# EAGLE design Uno&mux74hc151 (EAGLE 9.6.2)
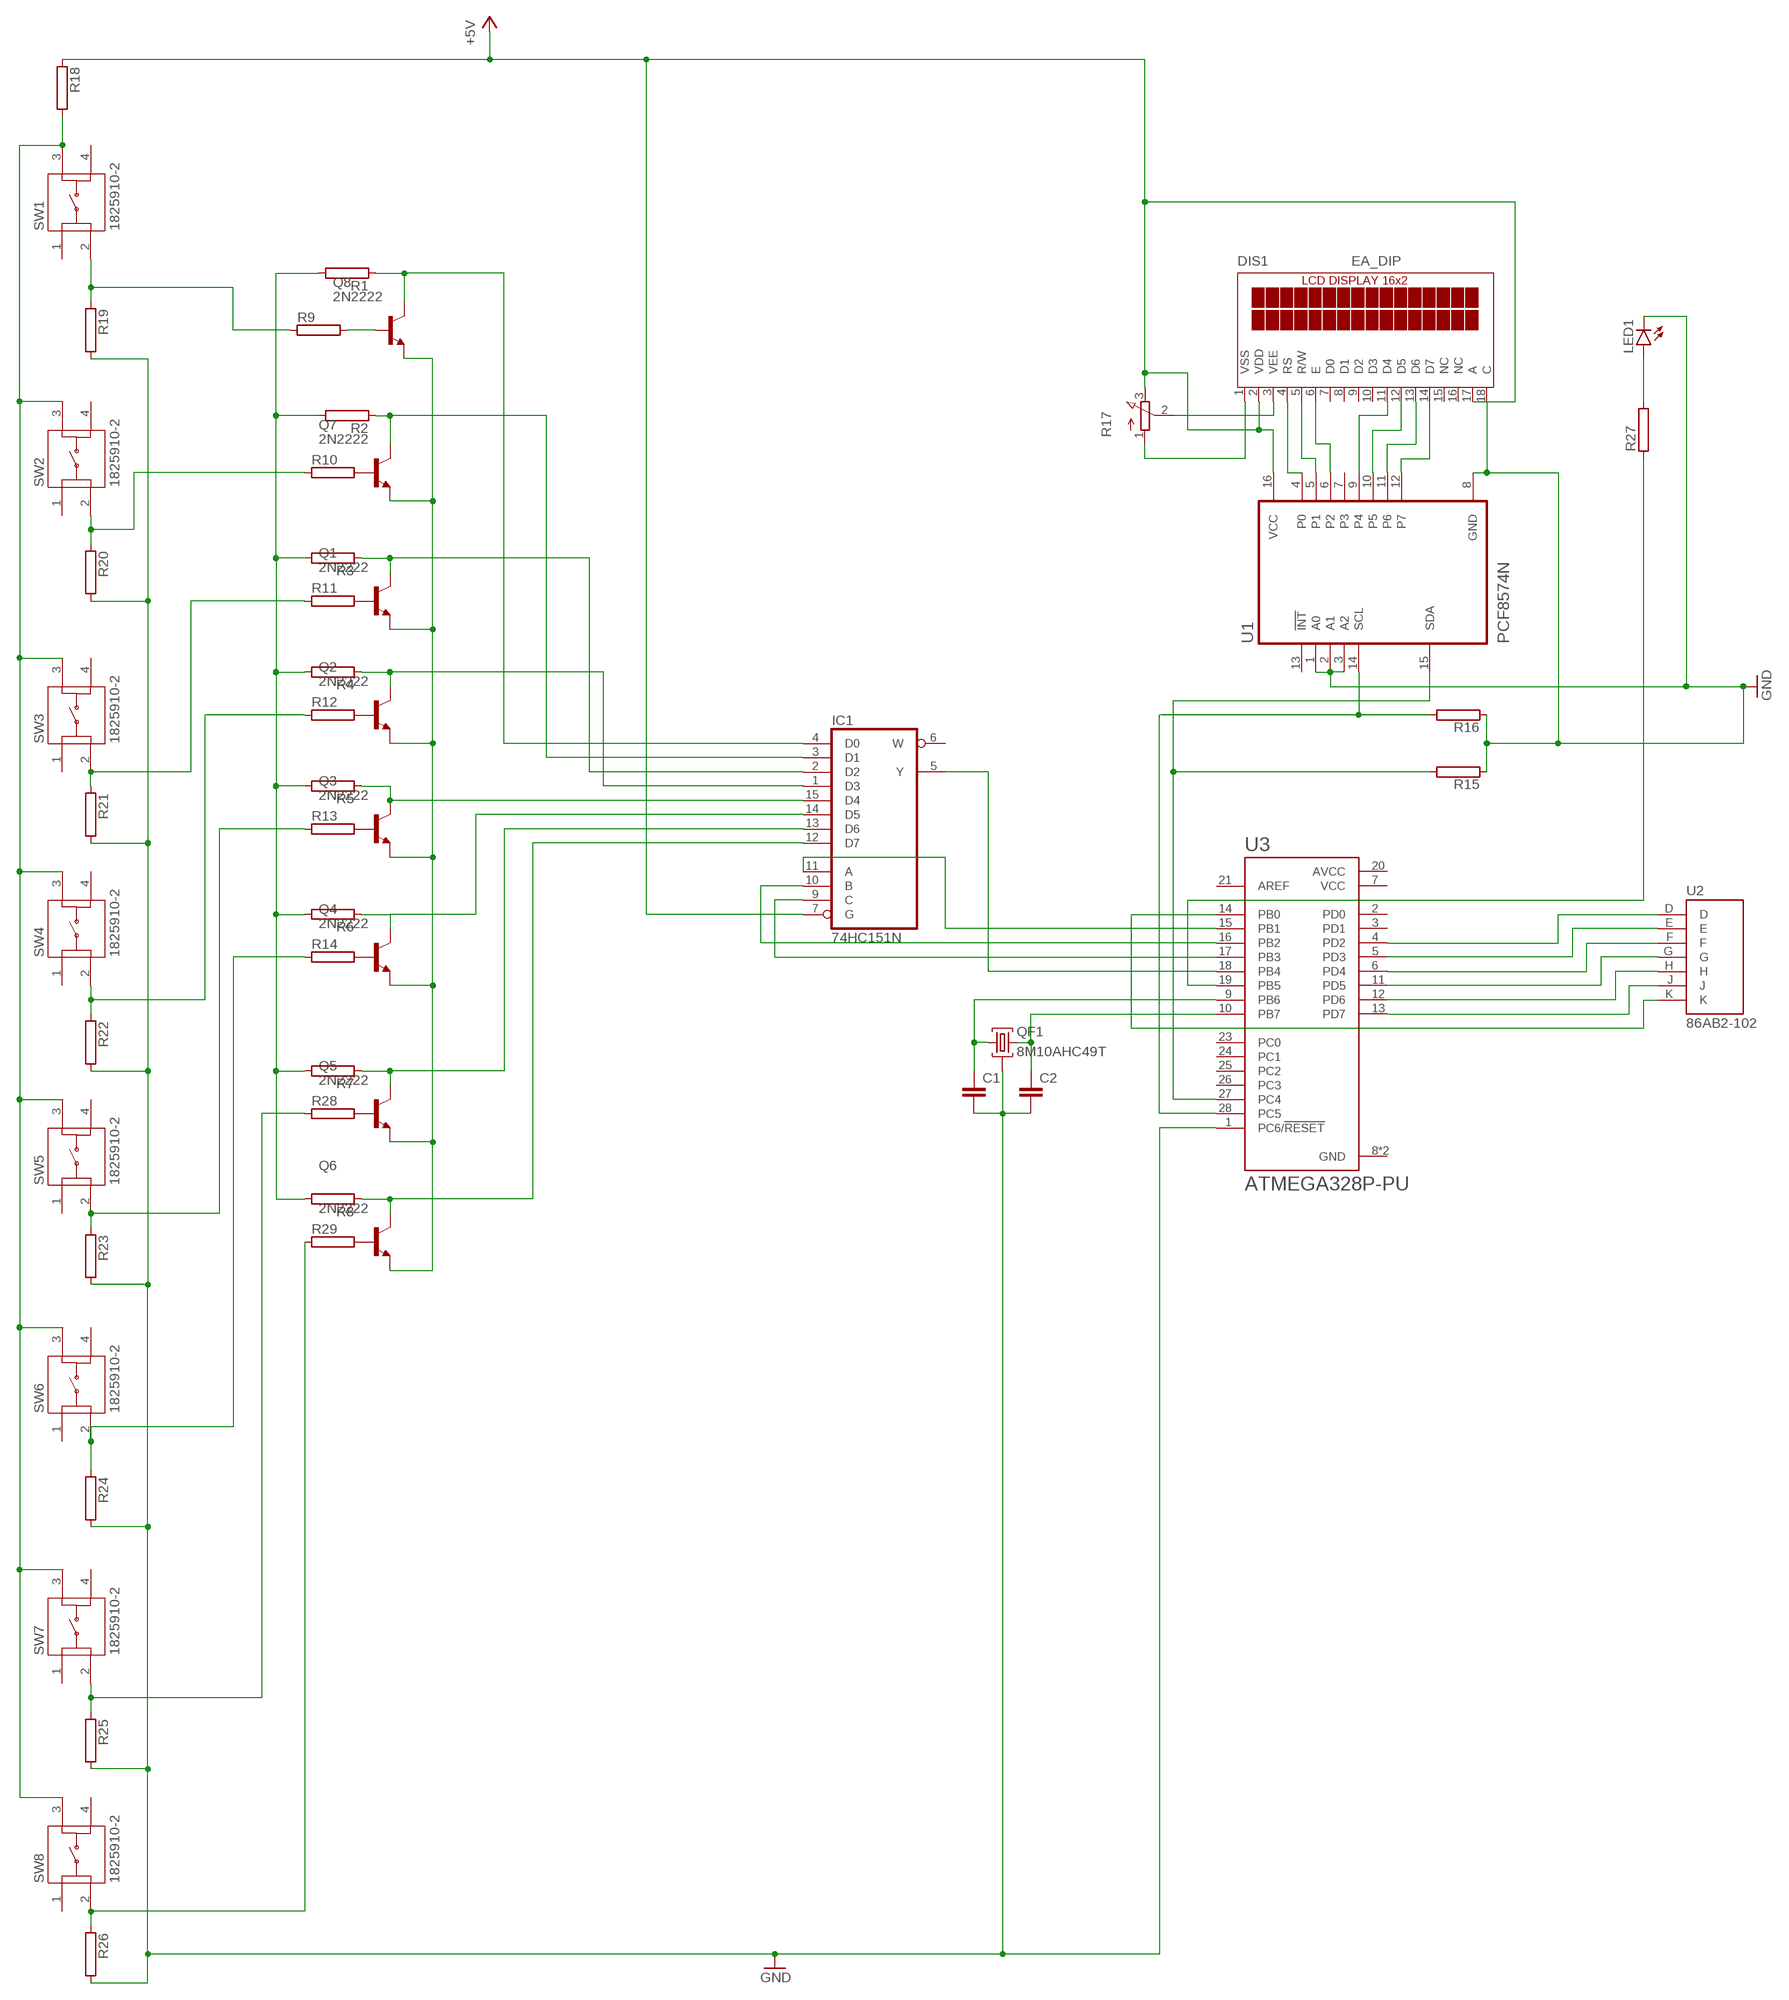
[diagram p0: schematic, sheet 1]

## Parts
C1  C2.5/2  [C2.5-2]
C2  C2.5/2  [C2.5-2]
DIS1  EA_DIP  [EA_DIP]
IC1  74HC151N  [DIL16]
LED1  LEDB153  [Q62902-B153]
Q1  2N2222  [TO18]
Q2  2N2222  [TO18]
Q3  2N2222  [TO18]
Q4  2N2222  [TO18]
Q5  2N2222  [TO18]
Q6  2N2222  [TO18]
Q7  2N2222  [TO18]
Q8  2N2222  [TO18]
QF1  8M10AHC49T  [HC49U]
R1  RAC01  [AC01]
R2  RAC01  [AC01]
R3  RAC01  [AC01]
R4  RAC01  [AC01]
R5  RAC01  [AC01]
R6  RAC01  [AC01]
R7  RAC01  [AC01]
R8  RAC01  [AC01]
R9  RAC01  [AC01]
R10  RAC01  [AC01]
R11  RAC01  [AC01]
R12  RAC01  [AC01]
R13  RAC01  [AC01]
R14  RAC01  [AC01]
R15  RAC01  [AC01]
R16  RAC01  [AC01]
R17  3RP/1610N  [3RP/1610N]
R18  RAC01  [AC01]
R19  RAC01  [AC01]
R20  RAC01  [AC01]
R21  RAC01  [AC01]
R22  RAC01  [AC01]
R23  RAC01  [AC01]
R24  RAC01  [AC01]
R25  RAC01  [AC01]
R26  RAC01  [AC01]
R27  RAC01  [AC01]
R28  RAC01  [AC01]
R29  RAC01  [AC01]
SW1  1825910-2  [TE_1825910-2]
SW2  1825910-2  [TE_1825910-2]
SW3  1825910-2  [TE_1825910-2]
SW4  1825910-2  [TE_1825910-2]
SW5  1825910-2  [TE_1825910-2]
SW6  1825910-2  [TE_1825910-2]
SW7  1825910-2  [TE_1825910-2]
SW8  1825910-2  [TE_1825910-2]
U1  PCF8574N  [DIP794W45P254L1969H508Q16]
U2  86AB2-102  [KEYPAD_86AB2-102]
U3  ATMEGA328P-PU  [DIP794W46P254L2967H457Q28B]

## Nets
+5V: DIS1.2(VDD) DIS1.17(A) IC1.7(G) R17.3(E) R18.1 U1.16(VCC)
GND: C1.2 C2.2 DIS1.18(C) LED1.K(C) QF1.2 R15.1 R16.1 R19.2 R20.2 R21.2 R22.2 R23.2 R24.2 R25.2 R26.2 U1.1(A0) U1.2(A1) U1.3(A2) U1.8(GND) U3.1(PC6/!RESET)
N$1: R16.2 U1.14(SCL) U3.28(PC5)
N$2: R15.2 U1.15(SDA) U3.27(PC4)
N$3: U2.D U3.4(PD2)
N$4: U2.E U3.5(PD3)
N$5: U2.F U3.6(PD4)
N$6: U2.G U3.11(PD5)
N$7: DIS1.14(D7) U1.12(P7)
N$8: DIS1.13(D6) U1.11(P6)
N$9: DIS1.11(D4) U1.9(P4)
N$10: DIS1.12(D5) U1.10(P5)
N$11: DIS1.6(E) U1.6(P2)
N$12: DIS1.5(R/W) U1.5(P1)
N$13: DIS1.4(RS) U1.4(P0)
N$14: LED1.A R27.2
N$15: IC1.5(Y) U3.18(PB4)
N$16: R10.1 R20.1 SW2.2
N$17: IC1.3(D1) Q7.3(C) R2.1
N$18: IC1.2(D2) Q1.3(C) R3.1
N$19: IC1.1(D3) Q2.3(C) R4.1
N$20: IC1.15(D4) Q3.3(C) R5.1
N$21: IC1.14(D5) Q4.3(C) R6.1
N$22: IC1.13(D6) Q5.3(C) R7.1
N$23: IC1.12(D7) Q6.3(C) R8.1
N$24: Q6.2(B) R29.2
N$25: Q5.2(B) R28.2
N$26: Q4.2(B) R14.2
N$27: Q3.2(B) R13.2
N$28: Q2.2(B) R12.2
N$29: Q1.2(B) R11.2
N$30: Q7.2(B) R10.2
N$31: Q8.2(B) R9.2
N$32: R1.2 R2.2 R3.2 R4.2 R5.2 R6.2 R7.2 R8.2
N$33: R9.1 R19.1 SW1.2
N$36: R12.1 R22.1 SW4.2
N$37: R13.1 R23.1 SW5.2
N$38: R14.1 R24.1 SW6.2
N$39: R25.1 R28.1 SW7.2
N$41: C2.1 QF1.3 U3.10(PB7)
N$42: C1.1 QF1.1 U3.9(PB6)
N$43: Q1.1(E) Q2.1(E) Q3.1(E) Q4.1(E) Q5.1(E) Q6.1(E) Q7.1(E) Q8.1(E)
N$44: IC1.4(D0) Q8.3(C) R1.1
N$45: IC1.11(A) U3.15(PB1)
N$46: R18.2 SW1.3 SW2.3 SW3.3 SW4.3 SW5.3 SW6.3 SW7.3 SW8.3
N$47: U2.H U3.12(PD6)
N$48: U2.J U3.13(PD7)
N$49: IC1.10(B) U3.16(PB2)
N$50: U2.K U3.14(PB0)
N$51: IC1.9(C) U3.17(PB3)
N$52: R11.1 R21.1 SW3.2
N$53: DIS1.1(VSS) R17.1(A)
N$54: DIS1.3(VEE) R17.2(S)
N$57: R27.1 U3.19(PB5)
N$58: R26.1 R29.1 SW8.2
Unconnected: DIS1.7(D0) DIS1.8(D1) DIS1.9(D2) DIS1.10(D3) DIS1.15(NC) DIS1.16(NC) IC1.6(W) SW1.1 SW1.4 SW2.1 SW2.4 SW3.1 SW3.4 SW4.1 SW4.4 SW5.1 SW5.4 SW6.1 SW6.4 SW7.1 SW7.4 SW8.1 SW8.4 U1.7(P3) U1.13(!INT) U3.2(PD0) U3.3(PD1) U3.21(AREF) U3.23(PC0) U3.24(PC1) U3.25(PC2) U3.26(PC3)

## Power pins joined to a net without a drawn wire
AVCC: U3.20(AVCC)
GND: IC1.8(GND) U3.8(GND) U3.22(GND)
VCC: IC1.16(VCC) U3.7(VCC)

## Library data of the parts
C1 C2 = capacitor-wima:C: CAPACITOR naming: grid - package width
DIS1 = display-lcd:EA_DIP: LCD-MODUL 2x16 - 6,68mm, INKL. KONTROLLER HD44780 Source: Data sheet <http://www.lcd-module.de/pdf/doma/dip162-d.pdf>
IC1 = 74xx-eu:74*151: Data SELECTOR/MULTIPLEXER
LED1 = led:LED: LED OSRAM: - CHIPLED LG R971, LG N971, LY N971, LG Q971, LY Q971, LO R971, LY R971 LH N974, LH R974 LS Q976, LO Q976, LY Q976 LO Q996 - Hyper CHIPLED LW Q18S LB Q993, LB Q99A, LB R99A - SideLED LS A670, LO A670, LY A670, LG A670, LP A670 LB A673, LV A673, LT A673, LW A673 LH A674 LY A675 LS A676, LA A676, LO A676, LY A676, LW A676 LS A679, LY A679, LG A679 - Hyper Micro SIDELED® LS Y876, LA Y876, LO Y876, LY Y876 LT Y87S - SmartLED LW L88C, LW L88S LB L89C, LB L89S, LG L890 LS L89K, LO L89K, LY L89K LS L896, LA L896, LO L896, LY L896 - TOPLED LS T670, LO T670, LY T670, LG T670, LP T670 LSG T670, LSP T670, LSY T670, LOP T670, LYG T670 LG T671, LOG T671, LSG T671 LB T673, LV T673, LT T673, LW T673 LH T674 LS T676, LA T676, LO T676, LY T676, LB T676, LH T676, LSB T676, LW T676 LB T67C, LV T67C, LT T67C, LS T67K, LO T67K, LY T67K, LW E67C LS E67B, LA E67B, LO E67B, LY E67B, LB E67C, LV E67C, LT E67C LW T67C LS T679, LY T679, LG T679 LS T770, LO T770, LY T770, LG T770, LP T770 LB T773, LV T773, LT T773, LW T773 LH T774 LS E675, LA E675, LY E675, LS T675 LS T776, LA T776, LO T776, LY T776, LB T776 LHGB T686 LT T68C, LB T68C - Hyper Mini TOPLED® LB M676 - Mini TOPLED Santana® LG M470 LS M47K, LO M47K, LY M47K Source: http://www.osram.convergy.de LUXEON: - LUMILED® LXK2-PW12-R00, LXK2-PW12-S00, LXK2-PW14-U00, LXK2-PW14-V00 LXK2-PM12-R00, LXK2-PM12-S00, LXK2-PM14-U00 LXK2-PE12-Q00, LXK2-PE12-R00, LXK2-PE12-S00, LXK2-PE14-T00, LXK2-PE14-U00 LXK2-PB12-K00, LXK2-PB12-L00, LXK2-PB12-M00, LXK2-PB14-N00, LXK2-PB14-P00, LXK2-PB14-Q00 LXK2-PR12-L00, LXK2-PR12-M00, LXK2-PR14-Q00, LXK2-PR14-R00 LXK2-PD12-Q00, LXK2-PD12-R00, LXK2-PD12-S00 LXK2-PH12-R00, LXK2-PH12-S00 LXK2-PL12-P00, LXK2-PL12-Q00, LXK2-PL12-R00 Source: www.luxeon.com KINGBRIGHT: KA-3528ASYC Source: www.kingbright.com
Q1-Q8 = transistor-npn:2N2222*: NPN Transistor
QF1 = crystal:8M10AHC49T: Monolithic Crystal Filters Source: www.vanlong.com; OC_FARNELL: unknown; OC_NEWARK: unknown
R1-R16 R18-R29 = resistor-power:R: Power Resitor; OC_FARNELL: unknown; OC_NEWARK: unknown
R17 = pot:3RP/1610N: 16mm Potentiometer one level Source: http://www.alphapotentiometers.net/html/16mm_pot_2.html
SW1-SW8 = 1825910-2:1825910-2: SWITCH TACTILE SPST-NO 0.05A 24V Check availability <https://pricing.snapeda.com/parts/1825910-2/TE%20Connectivity/view-part?ref=eda>; AVAILABILITY: In Stock; COMMENT: 1825910-2; CONFIGURATION_POLE-THROW: Single Pole - Single Throw; CONTACT_CURRENT_RATING: 50 mA; DESCRIPTION: 50 mA SPST Round Actuator 160 Gram Force Tactile Pushbutton Switch; EU_ROHS_COMPLIANCE: Compliant; MF: TE Connectivity; MP: 1825910-2; PACKAGE: None; PRICE: None; PURCHASE-URL: https://pricing.snapeda.com/search/part/1825910-2/?ref=eda
U1 = PCF8574N:PCF8574N: Check availability <https://pricing.snapeda.com/parts/PCF8574N/Texas%20Instruments/view-part?ref=eda>; AVAILABILITY: In Stock; DESCRIPTION: 8-bit 2.5- to 5.5-V I2C/SMBus I/O expander with interrupt; MF: Texas Instruments; MP: PCF8574N; PACKAGE: PDIP-16 Texas Instruments; PRICE: None; PURCHASE-URL: https://pricing.snapeda.com/search/part/PCF8574N/?ref=eda
U2 = 86AB2-102:86AB2-102: Keypad Switch 12 Polymer Keys Snap Dome Contacts Matrix Output Non-Illuminated 0.01A 24VDC Check availability <https://pricing.snapeda.com/parts/86AB2-102/Grayhill%20Inc./view-part?ref=eda>; AVAILABILITY: In Stock; DESCRIPTION: Keypad Switch 12 Polymer Keys Snap Dome Contacts Matrix Output Non-Illuminated 0.01A @ 24VDC; MF: Grayhill Inc.; MP: 86AB2-102; PACKAGE: None; PRICE: None; PURCHASE-URL: https://pricing.snapeda.com/search/part/86AB2-102/?ref=eda
U3 = ATMEGA328P-PU:ATMEGA328P-PU: ATmega Series 20 MHz 32 KB Flash 2 KB SRAM 8-Bit Microcontroller - DIP-28 Check availability <https://pricing.snapeda.com/parts/ATMEGA328P-PU/Microchip/view-part?ref=eda>; AVAILABILITY: In Stock; DESCRIPTION: AVR AVR® ATmega Microcontroller IC 8-Bit 20MHz 32KB (16K x 16) FLASH 28-PDIP; MF: Microchip; MP: ATMEGA328P-PU; PACKAGE: PDIP-28 Atmel; PRICE: None; PURCHASE-URL: https://pricing.snapeda.com/search/part/ATMEGA328P-PU/?ref=eda

## Board
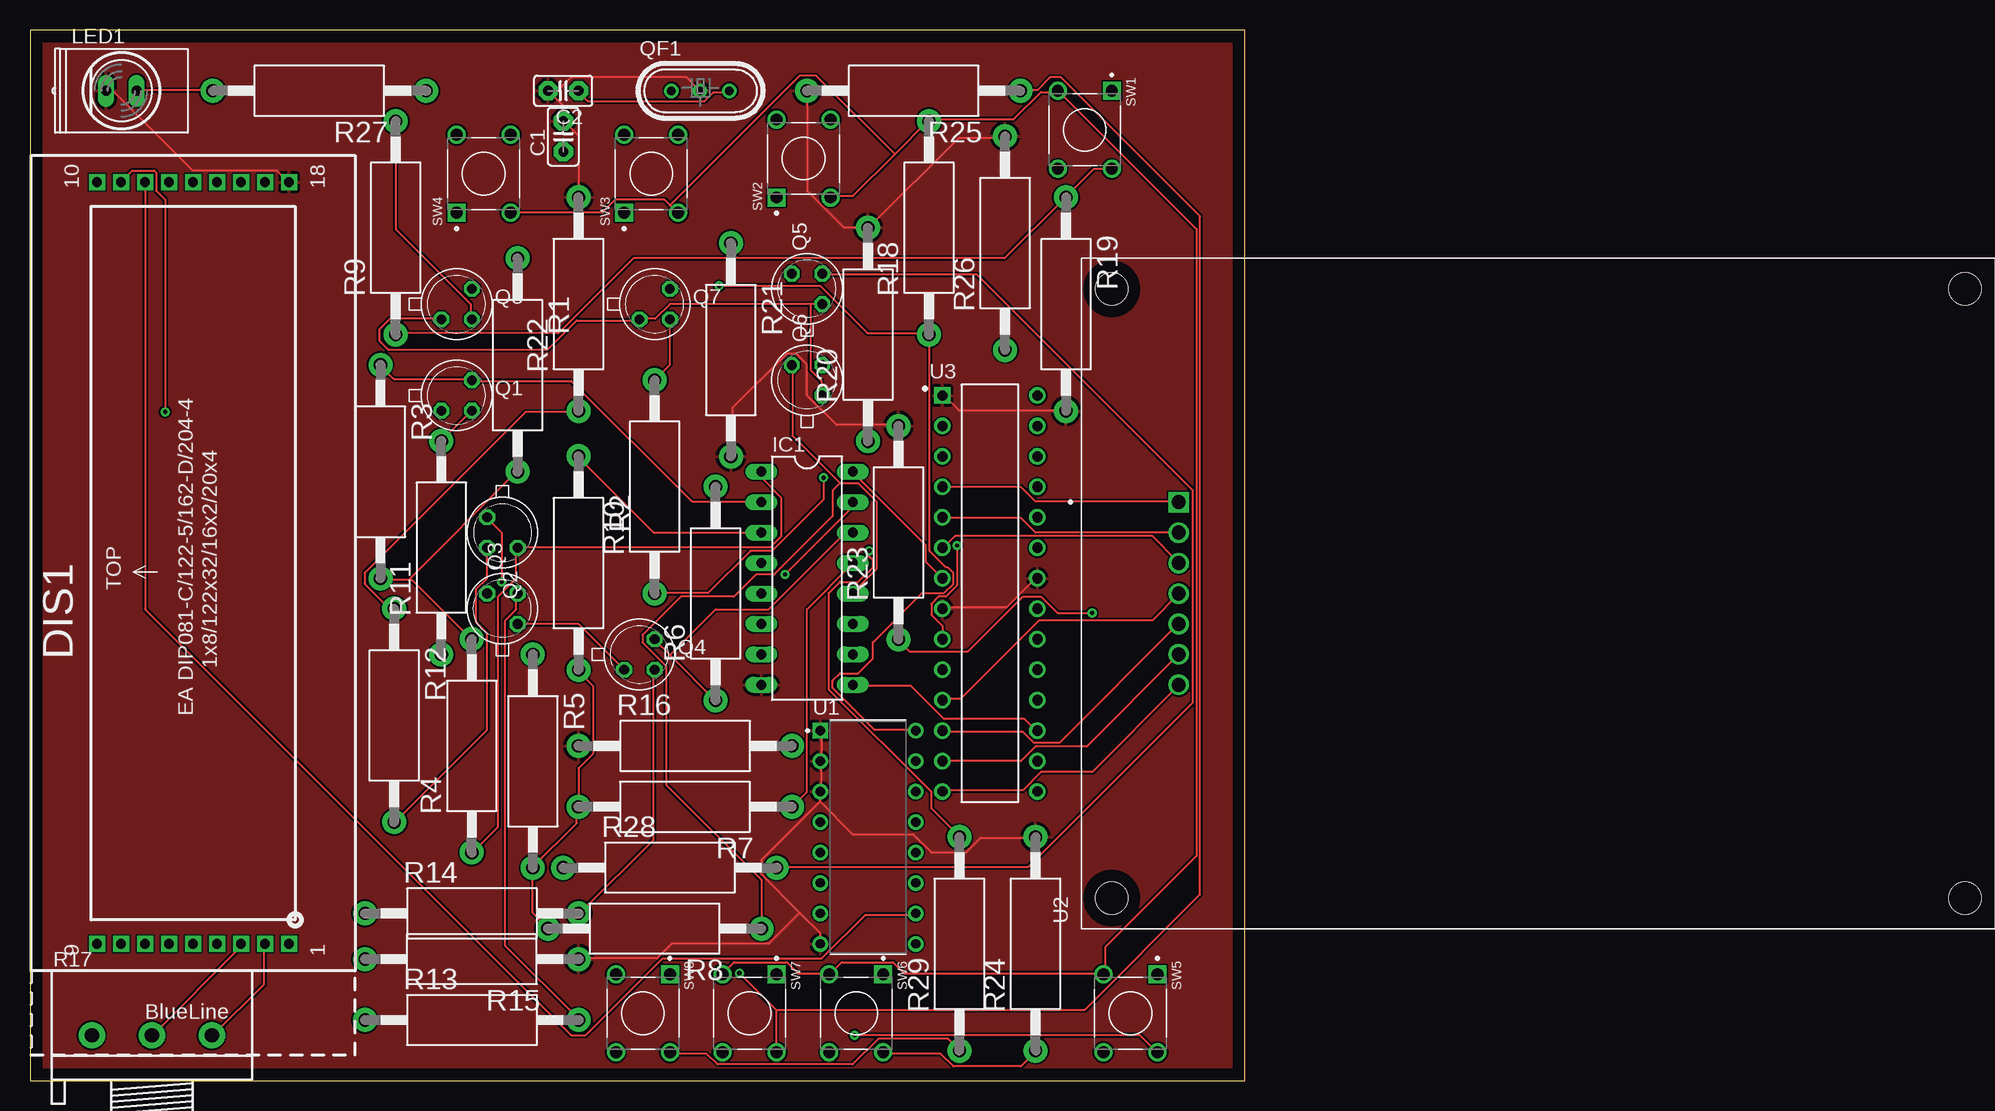
[diagram p1: board, top side]
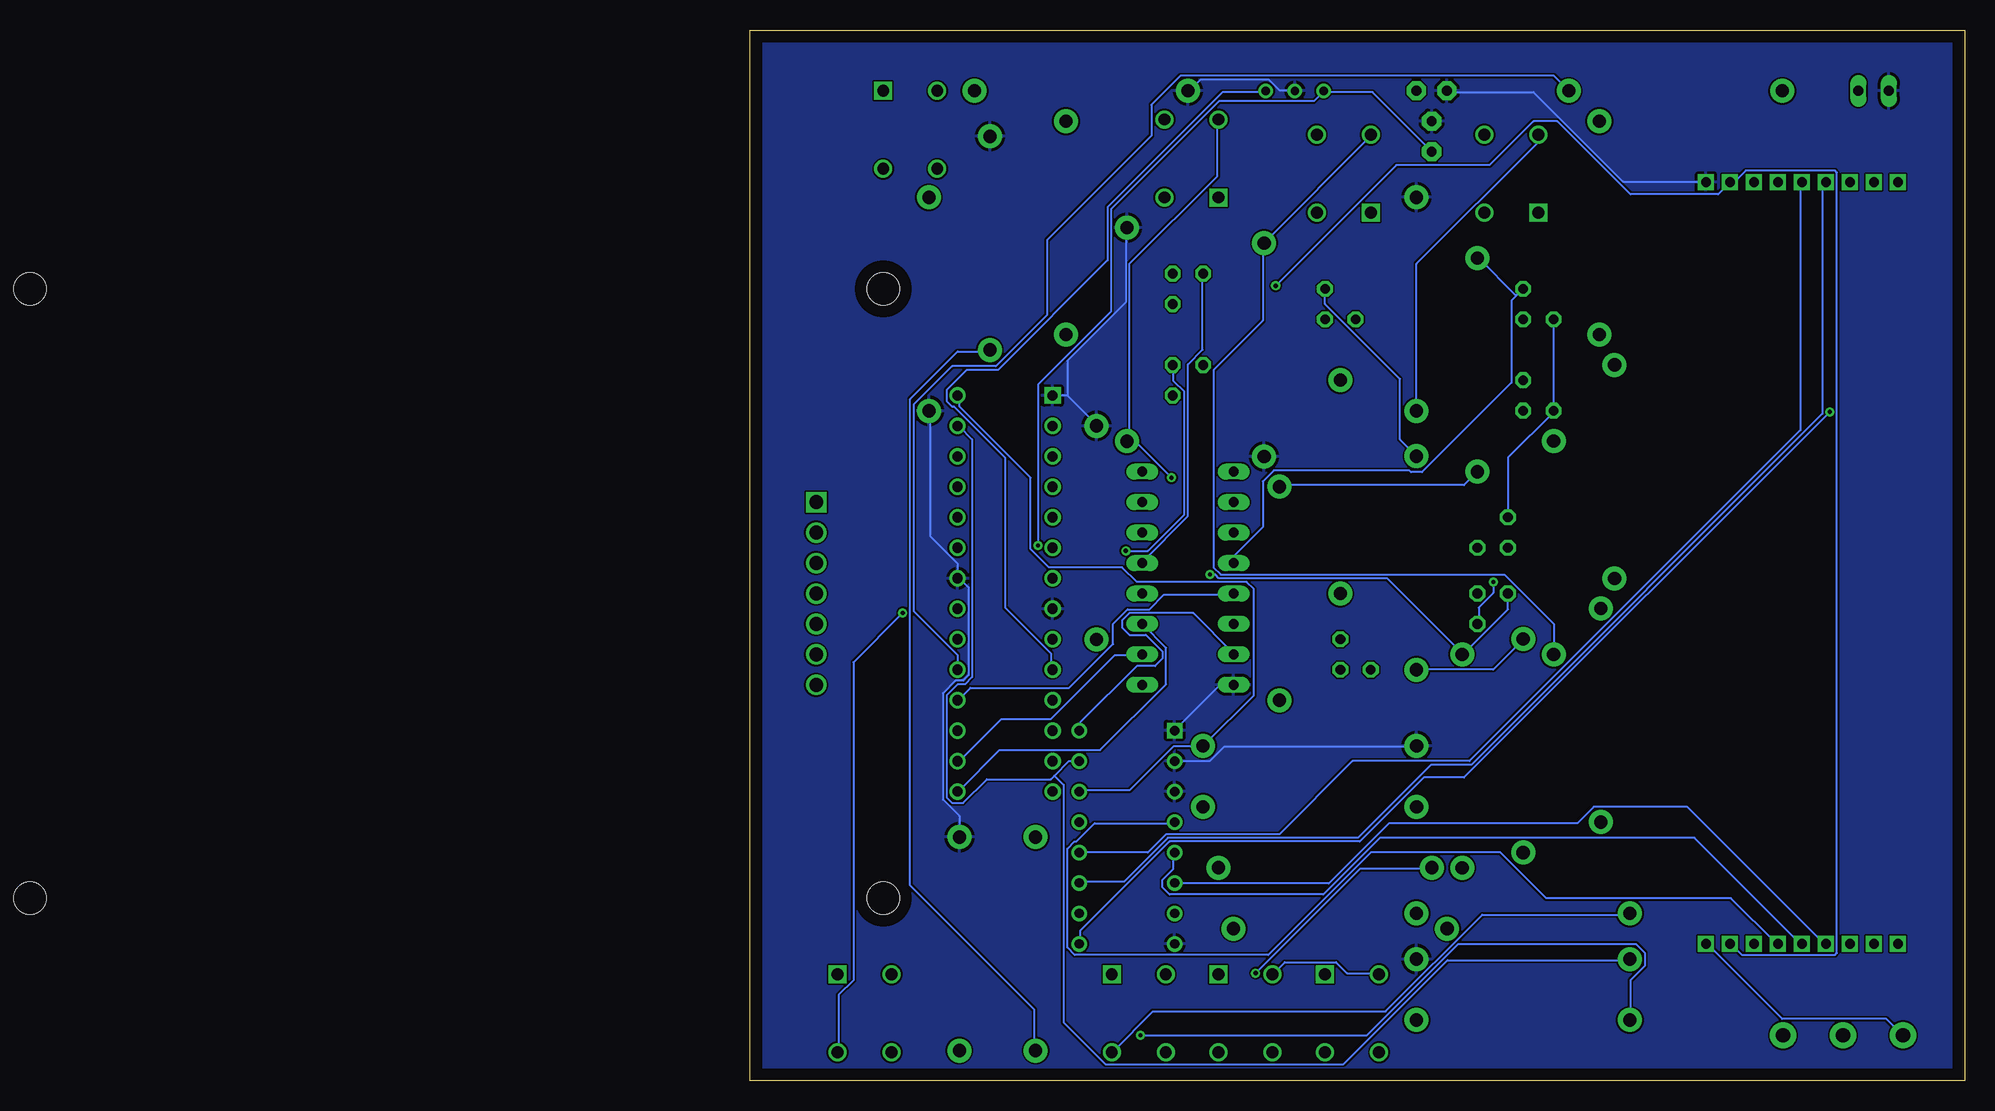
[diagram p2: board, bottom side, seen from below]

Size 101.27 x 87.62 mm. Coordinates in mm from the lower left corner, seen from the top.
Outline: 0,0 101.27,0 101.27,87.62 0,87.62 0,0
Copper layers (1*16): Top 0.035mm / dielectric 1.5mm / Bottom 0.035mm
Design rules "default": minimum track width 6mil, minimum drill 0.35mm, track to track 6mil, track to pad 6mil, pad to pad 6mil, via to via 6mil, smd to smd 6mil, copper to edge 40mil, drill to drill 6mil, minimum pad ring 10mil, minimum via ring 8mil, stop-mask expansion 4mil, vias tented up to drill 0mil, thermal gap 10mil

### Footprints (pad centres in the part's own frame; a part is rotated, then mirrored left to right if it is on the bottom)
C2.5-2 = drill 0.813 pad 1.6 octagon: 1 -1.27,0; 2 1.27,0
EA_DIP = drill 0.813 pad 1.27 square: 1 0,0; 2 0,2; 3 0,4; 4 0,6; 5 0,8; 6 0,10; 7 0,12; 8 0,14; 9 0,16; 10 63.5,16; 11 63.5,14; 12 63.5,12; 13 63.5,10; 14 63.5,8; 15 63.5,6; 16 63.5,4; 17 63.5,2; 18 63.5,0
DIL16 = drill 0.813 long: 1 -8.89,-3.81; 2 -6.35,-3.81; 3 -3.81,-3.81; 4 -1.27,-3.81; 5 1.27,-3.81; 6 3.81,-3.81; 7 6.35,-3.81; 8 8.89,-3.81; 9 8.89,3.81; 10 6.35,3.81; 11 3.81,3.81; 12 1.27,3.81; 13 -1.27,3.81; 14 -3.81,3.81; 15 -6.35,3.81; 16 -8.89,3.81
Q62902-B153 = drill 0.813 long: A 1.27,0; K -1.27,0
TO18 = drill 0.813 octagon: 1 -1.27,-1.27; 2 1.27,-1.27; 3 1.27,1.27
HC49U = drill 0.7 pad 1.2: 1 -2.413,0; 2 -0.027,0; 3 2.413,0
AC01 = drill 1.1 pad 2: 1 -8.9,0; 2 8.9,0
3RP/1610N = drill 1.2 pad 2.184: 1 -5,0; 2 0,0; 3 5,0
TE_1825910-2 = drill 0.99 square: 1 0,0 | drill 0.99: 2 6.5,0; 3 0,-4.5; 4 6.5,-4.5
DIP794W45P254L1969H508Q16 = drill 0.78 pad 1.13 square: 1 -3.97,8.89 | drill 0.78 pad 1.13: 2 -3.97,6.35; 3 -3.97,3.81; 4 -3.97,1.27; 5 -3.97,-1.27; 6 -3.97,-3.81; 7 -3.97,-6.35; 8 -3.97,-8.89; 9 3.97,-8.89; 10 3.97,-6.35; 11 3.97,-3.81; 12 3.97,-1.27; 13 3.97,1.27; 14 3.97,3.81; 15 3.97,6.35; 16 3.97,8.89
KEYPAD_86AB2-102 = drill 1.14 square: D 7.62,29.97 | drill 1.14: E 5.08,29.97; F 2.54,29.97; G 0,29.97; H -2.54,29.97; J -5.08,29.97; K -7.62,29.97 | hole 2.69: -25.4,35.56; 25.4,-35.56; 25.4,35.56; -25.4,-35.56
DIP794W46P254L2967H457Q28B = drill 0.85 square: 1 -3.96,16.51 | drill 0.85: 2 -3.96,13.97; 3 -3.96,11.43; 4 -3.96,8.89; 5 -3.96,6.35; 6 -3.96,3.81; 7 -3.96,1.27; 8 -3.96,-1.27; 9 -3.96,-3.81; 10 -3.96,-6.35; 11 -3.96,-8.89; 12 -3.96,-11.43; 13 -3.96,-13.97; 14 -3.96,-16.51; 15 3.96,-16.51; 16 3.96,-13.97; 17 3.96,-11.43; 18 3.96,-8.89; 19 3.96,-6.35; 20 3.96,-3.81; 21 3.96,-1.27; 22 3.96,1.27; 23 3.96,3.81; 24 3.96,6.35; 25 3.96,8.89; 26 3.96,11.43; 27 3.96,13.97; 28 3.96,16.51

### Placement (x,y rotation side)
C1  44.45,78.74 90 top
C2  44.45,82.55 180 top
DIS1  21.59,11.43 90 top
IC1  64.77,41.91 270 top
LED1  7.62,82.55 0 top
Q1  35.56,57.15 0 top
Q2  39.37,45.72 270 top
Q3  39.37,39.37 90 top
Q4  50.8,35.56 0 top
Q5  64.77,66.04 90 top
Q6  64.77,58.42 90 top
Q7  52.07,64.77 0 top
Q8  35.56,64.77 0 top
QF1  55.88,82.55 0 top
R1  40.64,59.69 270 top
R2  45.72,43.18 270 top
R3  29.21,50.8 270 top
R4  36.83,27.94 90 top
R5  41.91,26.67 270 top
R6  57.15,40.64 90 top
R7  54.61,22.86 180 top
R8  52.07,12.7 180 top
R9  30.48,71.12 90 top
R10  52.07,49.53 90 top
R11  34.29,44.45 90 top
R12  30.35,30.48 270 top
R13  36.83,5.08 0 top
R14  36.83,13.97 0 top
R15  36.83,10.16 180 top
R16  54.61,27.94 0 top
R17  10.16,3.81 0 top
R18  74.93,71.12 90 top
R19  86.36,64.77 270 top
R20  69.85,62.23 90 top
R21  58.42,60.96 270 top
R22  45.72,64.77 90 top
R23  72.39,45.72 90 top
R24  83.82,11.43 90 top
R25  73.66,82.55 180 top
R26  81.28,69.85 90 top
R27  24.13,82.55 180 top
R28  53.34,17.78 0 top
R29  77.47,11.43 90 top
SW1  90.17,82.55 270 top
SW2  62.23,73.66 90 top
SW3  49.53,72.39 90 top
SW4  35.56,72.39 90 top
SW5  93.98,8.89 270 top
SW6  71.12,8.89 270 top
SW7  62.23,8.89 270 top
SW8  53.34,8.89 270 top
U1  69.85,20.32 0 top
U2  125.73,40.64 90 top
U3  80.01,40.64 0 top

### Tracks (layer width: path | path; a pad name or v marks a point on that pad's centre or on a via)
+5V  (via drill 0.35)
  Top 0.152: U1.16 73.76,29.26 70.41,29.26 66.9,32.77 66.9,33.38 67.51,33.98 69.04,33.98 70.26,35.2 70.26,36.58 74.37,40.69 76.2,40.69 76.96,41.45 76.96,42.37 76.5,42.82 76.35,42.82 74.98,44.2 74.98,62.18 R18.1 74.83,62.33 69.8,62.33 65.84,66.29 v57.45,66.29 | DIS1.2 19.51,11.43 19.51,8.08 15.24,3.81 R17.3
  Bottom 0.152: U1.16 73.76,29.26 73.76,29.87 69.04,34.59 67.51,34.59 66.9,35.2 66.9,35.81 68.28,37.19 69.65,37.19 70.26,37.8 70.26,38.41 69.65,39.01 64.31,39.01 60.96,35.66 IC1.7 | DIS1.2 19.51,11.43 18.59,10.52 10.82,10.52 10.67,10.67 10.67,75.74 10.82,75.89 18.29,75.89 19.2,74.98 19.51,74.98 DIS1.17 19.66,74.83 20.57,73.91 27.89,73.91 33.98,80.01 35.97,80.01 39.62,76.35 47.4,76.35 v57.45,66.29
GND
  Top 0.152: 65.99,26.67 65.99,29.11 U1.1 | 64.16,14.02 60.96,17.22 60.96,18.44 65.84,23.32 | 64.16,14.02 65.84,12.34 65.84,11.43 U1.8 | 65.84,23.32 65.84,24.08 U1.3 65.99,24.23 65.99,26.67 | 64.16,14.02 61.57,11.43 53.49,11.43 52.27,10.21 45.87,10.21 R15.1 | 65.84,23.32 68.58,20.57 73.61,20.57 75.13,19.05 78.03,19.05 79.25,20.27 83.82,20.27 R24.2 | 65.99,26.67 U1.2 | U3.8 76.2,39.47 81.38,39.47 83.82,41.91 U3.22 | R21.2 58.52,52.12 58.52,56.08 63.09,60.66 63.86,60.66 64.77,59.74 64.77,57.15 67.21,54.71 72.39,54.71 R23.2 | R19.2 86.26,55.93 77.42,55.93 76.2,57.15 U3.1 | LED1.K 6.4,82.45 7.01,82.45 13.56,75.89 20.57,75.89 21.49,74.98 DIS1.18 | 43.59,82.14 C2.2 43.28,82.45 | 43.59,82.14 44.35,81.38 44.35,80.01 C1.2 44.5,80.01 45.72,78.79 R22.2 | R25.2 64.77,82.45 64.77,74.22 67.82,71.17 69.8,71.17 R20.2 69.95,71.17 77.42,78.64 81.23,78.64 R26.2 | 43.59,82.14 45.11,83.67 54.71,83.67 55.78,82.6 QF1.2
  Bottom 0.152: IC1.8 60.96,32.92 62.18,32.92 65.84,29.26 U1.1 | U1.2 62.94,26.67 61.72,27.89 45.72,27.89 R16.1 | 74.83,57.15 U3.1 | 74.83,57.15 72.39,54.71 R23.2 | R19.2 86.26,55.78 86.26,45.41 83.97,43.13 U3.22 83.82,41.91 83.06,41.15 83.06,33.83 83.52,33.38 84.12,33.38 85.19,32.31 85.19,23.47 83.82,22.1 R24.2 | QF1.2 55.93,82.6 57.15,82.6 58.06,83.52 63.7,83.52 64.62,82.6 R25.2 | DIS1.18 21.64,74.98 28.5,74.98 35.97,82.45 43.13,82.45 C2.2 | 74.83,57.15 74.83,60.05 69.95,64.92 69.95,71.02 R20.2
  pour Top: 0,0 0,87.63 101.6,87.63 101.6,0
  pour Bottom: 0,0 0,87.63 101.6,87.63 101.6,0
N$1
  Bottom 0.152: U1.14 73.76,24.23 69.65,24.23 65.99,27.89 63.55,27.89 R16.2 63.4,28.04 59.28,32.16 59.28,41 59.89,41.6 69.04,41.6 70.26,42.82 76.35,42.82 77.88,44.35 77.88,50.29 83.82,56.24 83.82,57.15 U3.28
N$2
  Bottom 0.152: U1.15 74.68,26.67 75.89,25.45 | 75.89,25.45 76.2,25.15 81.53,25.15 83.52,23.16 84.43,23.16 84.89,23.62 84.89,32.16 83.97,33.07 83.36,33.07 82.75,33.68 82.75,53.49 83.82,54.56 U3.27 | 75.89,25.45 75.13,24.69 75.13,4.88 71.63,1.37 51.82,1.37 43.13,10.06 28.04,10.06 R15.2
N$3
  Top 0.152: U3.4 82.6,49.53 83.82,48.31 95.71,48.31 U2.D
N$4
  Top 0.152: U2.E 83.82,45.72 82.6,46.94 76.2,46.94 U3.5
N$5
  Top 0.152: U3.6 76.2,44.5 77.11,45.41 93.57,45.41 95.71,43.28 U2.F
N$6
  Top 0.152: U3.11 76.2,31.85 77.57,31.85 84.12,38.41 93.57,38.41 95.71,40.54 U2.G
N$7
  Bottom 0.152: U1.12 68.12,19.05 66.6,20.57 57.15,20.57 51.05,26.67 41.3,26.67 13.72,54.25 13.72,74.83 DIS1.14
N$8
  Bottom 0.152: U1.11 73.76,16.61 70.1,16.61 66.45,20.27 50.6,20.27 44.5,26.36 41.15,26.36 11.89,55.63 11.89,74.68 11.73,74.83 DIS1.13
N$9  (via drill 0.35)
  Top 0.152: v11.28,55.78 11.28,73.46 10.52,74.22 10.52,75.74 10.36,75.89 8.53,75.89 7.62,74.98 DIS1.11
  Bottom 0.152: v11.28,55.78 41.76,25.3 45.11,25.3 50.44,19.96 66.29,19.96 73.76,12.5 73.76,11.43 U1.9
N$10
  Top 0.152: U1.10 73.76,13.87 69.65,13.87 65.99,10.21 52.73,10.21 46.33,3.81 45.11,3.81 9.6,39.32 9.6,74.83 DIS1.12
N$11
  Bottom 0.152: U1.6 65.84,16.46 53.03,16.46 48.01,21.49 32.31,21.49 30.94,22.86 23.16,22.86 11.73,11.43 DIS1.6
N$12
  Bottom 0.152: U1.5 65.99,19.05 65.99,17.68 66.9,16.76 66.9,16.15 66.29,15.54 53.49,15.54 48.77,20.27 22.55,20.27 13.72,11.43 DIS1.5
N$13
  Bottom 0.152: U1.4 65.99,21.49 72.54,21.49 74.07,19.96 74.22,19.96 74.83,19.36 74.83,11.12 74.22,10.52 58.06,10.52 49.53,19.05 38.71,19.05 34.9,15.24 19.51,15.24 15.7,11.43 DIS1.4
N$14
  Top 0.152: LED1.A 8.99,82.6 15.09,82.6 R27.2
N$15
  Bottom 0.152: IC1.5 60.96,40.54 66.75,40.54 67.97,39.32 69.8,39.32 71.02,38.1 71.02,36.42 74.68,32.77 82.91,32.77 83.82,31.85 U3.18
N$16  (via drill 0.35)
  Top 0.152: v66.14,50.29 66.14,48.46 61.87,44.2 60.05,44.2 56.54,40.69 52.12,40.69 R10.1
  Bottom 0.152: 69.65,53.8 69.65,53.49 69.8,53.34 R20.1 69.65,53.8 | 69.65,53.8 69.65,68.12 62.33,75.44 62.33,80.01 SW2.2 | 69.65,53.8 v66.14,50.29
N$17
  Top 0.152: IC1.3 51.97,45.72 45.72,51.97 R2.1
  Bottom 0.152: Q7.3 53.34,64.77 47.09,58.52 47.09,53.49 45.72,52.12 R2.1
N$18
  Top 0.152: R3.1 29.26,59.59 30.33,58.52 36.73,58.52 Q1.3 36.88,58.37 45.11,58.37 55.17,48.31 60.96,48.31 IC1.2
N$19
  Top 0.152: R4.1 36.88,19.05 39.01,21.18 39.01,40.39 40.54,41.91 40.54,44.35 Q2.3 40.69,44.5 61.72,44.5 62.64,45.41 62.64,48.62 60.96,50.29 IC1.1
N$20  (via drill 0.35)
  Top 0.152: IC1.15 68.58,47.85 v62.94,42.22
  Bottom 0.152: Q3.3 38.1,39.32 41.91,35.51 R5.1 41.91,35.66 48.16,41.91 62.18,41.91 62.48,42.22 v62.94,42.22
N$21
  Top 0.152: 53.34,35.51 57.15,31.7 R6.1 | 53.34,35.51 52.12,36.73 Q4.3 | IC1.14 67.97,45.72 61.57,39.32 57.15,39.32 53.34,35.51
N$22
  Top 0.152: IC1.13 68.58,43.13 64.77,39.32 64.77,24.08 63.55,22.86 R7.1
  Bottom 0.152: Q5.3 63.55,67.21 63.55,60.96 64.77,59.74 64.77,47.09 68.58,43.28 IC1.13
N$23
  Top 0.152: 67.51,49.84 69.04,49.84 70.56,48.31 70.56,42.67 68.58,40.69 IC1.12 | 67.51,49.84 63.55,53.8 63.55,59.59 Q6.3 | 67.51,49.84 66.9,49.23 66.9,47.09 62.03,42.22 60.5,42.22 58.67,40.39 54.25,40.39 51.05,37.19 51.05,36.58 53.03,34.59 53.03,24.69 60.96,16.76 60.96,12.8 R8.1
N$24  (via drill 0.35)
  Top 0.152: v69.95,44.2 69.95,43.74 70.26,43.43 70.26,42.82 69.04,41.6 67.51,41.6 66.6,40.69 66.6,32.61 75.13,24.08 75.13,22.71 77.42,20.42 R29.2
  Bottom 0.152: v69.95,44.2 68.12,44.2 65.08,47.24 65.08,57.45 65.99,58.37 65.99,59.59 Q6.2
N$25
  Top 0.152: Q5.2 66.14,67.21 78.94,67.21 96.93,49.23 96.93,31.55 83.21,17.83 62.33,17.83 R28.2
N$26
  Top 0.152: Q4.2 51.97,34.29 51.97,20.12 45.87,14.02 R14.2
N$27
  Top 0.152: Q3.2 40.54,40.54 40.54,39.32 39.62,38.41 39.62,11.28 45.72,5.18 R13.2
N$28
  Top 0.152: Q2.2 38.1,41.91 37.19,41 37.19,38.25 38.1,37.34 38.1,29.26 30.48,21.64 R12.2
N$29
  Top 0.152: Q1.2 R11.2
N$30
  Top 0.152: Q7.2 53.34,59.74 52.12,58.52 R10.2
N$31
  Top 0.152: R9.2 30.48,71.02 36.73,64.77 36.73,63.55 Q8.2
N$32
  Top 0.152: R8.2 43.13,12.8 41.91,14.02 R5.2 41.91,17.83 45.57,21.49 45.57,22.86 R7.2 45.72,26.06 46.94,27.28 46.94,32.92 45.72,34.14 R2.2 | 31.55,41.76 31.85,41.76 36.73,36.88 R4.2 | 31.55,41.76 29.26,41.76 R3.2 | 31.55,41.76 40.54,50.75 R1.2
  Bottom 0.152: R2.2 39.32,34.29 36.88,36.73 R4.2 | R6.2 57.15,49.68 41.76,49.68 40.69,50.75 R1.2
N$33
  Top 0.152: SW1.2 90.07,76.05 88.7,76.05 86.41,73.76 R19.1 86.26,73.61 81.23,68.58 50.29,68.58 44.04,62.33 30.48,62.33 R9.1
N$36
  Top 0.152: R12.1 30.33,39.47 29.87,39.47 27.89,41.45 27.89,42.37 41.3,55.78 45.72,55.78 R22.1
  Bottom 0.152: R22.1 45.72,68.12 35.66,78.18 35.66,78.79 SW4.2
N$37  (via drill 0.35)
  Top 0.152: v88.54,39.01 85.65,39.01 84.28,40.39 82.75,40.39 78.18,35.81 73.3,35.81 72.39,36.73 R23.1 | v68.73,3.81 92.51,3.81 93.88,2.44 SW5.2
  Bottom 0.152: v88.54,39.01 92.66,34.9 92.66,8.38 93.88,7.16 93.88,2.44 SW5.2 | v68.73,3.81 49.84,3.81 42.22,11.43 27.43,11.43 26.67,10.67 26.67,9.6 27.89,8.38 27.89,5.18 R13.1
N$38
  Top 0.152: SW6.2 71.17,2.29 75.89,2.29 76.96,1.22 82.6,1.22 83.82,2.44 R24.1
  Bottom 0.152: R14.1 28.04,13.87 40.23,13.87 48.31,5.79 67.67,5.79 71.02,2.44 SW6.2
N$39  (via drill 0.35)
  Top 0.152: 62.18,5.94 62.18,2.44 SW7.2 | v59.13,8.99 62.18,5.94 | 62.18,5.94 87.94,5.94 97.54,15.54 97.54,72.08 85.95,83.67 85.04,83.67 83.97,82.6 82.6,82.6 R25.1
  Bottom 0.152: v59.13,8.99 50.44,17.68 44.5,17.68 R28.1
N$41
  Top 0.152: QF1.3 58.22,82.45 57,82.45 56.24,81.69 46.48,81.69 45.72,82.45 C2.1
  Bottom 0.152: U3.10 76.2,34.29 76.2,35.66 80.01,39.47 80.01,51.97 84.28,56.24 84.43,56.24 84.89,56.69 84.89,57.61 83.21,59.28 80.62,59.28 71.48,68.43 71.48,72.85 61.87,82.45 58.37,82.45 QF1.3
N$42  (via drill 0.35)
  Top 0.152: v77.27,44.65 77.27,41.3 76.35,40.39 75.74,40.39 75.13,39.78 75.13,38.86 76.05,37.95 76.05,36.88 U3.9
  Bottom 0.152: C1.1 44.5,77.57 49.38,82.45 53.34,82.45 QF1.1 53.49,82.45 54.25,81.69 62.18,81.69 71.17,72.69 71.17,64.16 77.27,58.06 v77.27,44.65
N$43  (via drill 0.35)
  Top 0.152: Q5.1 65.08,64.77 | 65.08,64.77 53.34,64.77 52.12,63.55 50.9,63.55 Q7.1 50.75,63.4 45.57,63.4 43.13,60.96 29.87,60.96 29.11,61.72 29.11,62.64 30.02,63.55 34.29,63.55 Q8.1 | 65.08,64.77 65.08,59.28 65.99,58.37 65.99,57.15 Q6.1 | Q3.1 45.72,38.1 Q4.1 | v39.32,41.6 39.32,45.72 38.1,46.94 Q2.1
  Bottom 0.152: Q2.1 38.1,51.97 34.29,55.78 Q1.1 Q8.1 | v39.32,41.6 39.32,40.69 40.54,39.47 40.54,38.1 Q3.1
N$44
  Bottom 0.152: IC1.4 60.96,43.74 58.52,46.18 58.52,49.99 57.61,50.9 46.33,50.9 46.18,50.75 45.26,50.75 37.8,58.22 37.8,65.08 37.34,65.53 | Q8.3 37.34,65.53 | 37.34,65.53 37.49,65.53 40.54,68.58 R1.1
N$45
  Bottom 0.152: IC1.11 66.6,36.12 66.6,33.07 72.08,27.58 80.47,27.58 83.82,24.23 U3.15
N$46
  Top 0.152: SW7.3 57.76,8.99 58.67,9.91 63.09,9.91 64.01,8.99 66.6,8.99 SW6.3 66.75,8.99 67.67,9.91 71.93,9.91 72.85,8.99 89.46,8.99 SW5.3 89.61,8.99 89.61,11.12 97.23,18.75 97.23,71.02 85.8,82.45 SW1.3 85.65,82.45 84.28,82.45 81.99,80.16 74.98,80.16 R18.2 74.83,80.01 72.08,77.27 | SW4.3 47.7,72.39 48.77,73.46 52.88,73.46 53.34,73 | 53.34,73 53.95,72.39 SW3.3 | 72.08,77.27 68.58,73.76 66.75,73.76 SW2.3 | 53.34,73 64.16,83.82 65.53,83.82 72.08,77.27
  Bottom 0.152: SW8.3 48.92,8.99 51.51,8.99 52.43,9.91 56.69,9.91 57.61,8.99 SW7.3
N$47
  Top 0.152: U3.12 76.2,29.11 82.75,29.11 83.67,28.19 85.8,28.19 95.71,38.1 U2.H
N$48
  Top 0.152: U3.13 82.6,26.67 83.82,27.89 88.09,27.89 95.71,35.51 U2.J
N$49
  Bottom 0.152: IC1.10 68.58,35.51 70.87,35.51 76.2,30.18 80.31,30.18 83.82,26.67 U3.16
N$50
  Top 0.152: U3.14 76.2,24.23 82.75,24.23 84.28,25.76 88.54,25.76 95.71,32.92 U2.K
N$51
  Top 0.152: IC1.9 68.58,32.92 73.46,32.92 76.2,30.18 82.91,30.18 83.82,29.26 U3.17
N$52
  Bottom 0.152: SW3.2 49.53,78.79 58.37,69.95 R21.1 58.52,69.8 58.52,63.4 62.64,59.28 62.64,42.82 62.03,42.22 38.41,42.22 34.29,38.1 R11.1
N$53
  Bottom 0.152: DIS1.1 21.49,11.43 15.24,5.18 6.55,5.18 5.18,3.81 R17.1
N$54
  Top 0.152: DIS1.3 17.53,11.43 17.53,11.12 10.21,3.81 R17.2
N$57
  Bottom 0.152: U3.19 83.97,35.51 87.63,39.17 87.63,56.39 84.43,59.59 80.77,59.59 76.5,63.86 76.5,70.1 67.82,78.79 67.82,81.38 65.38,83.82 34.29,83.82 33.07,82.6 R27.1
N$58
  Top 0.152: SW8.2 53.34,2.29 56.39,2.29 57.3,1.37 68.58,1.37 70.71,3.5 76.5,3.5 77.42,2.59 R29.1
  Bottom 0.152: R26.1 81.38,60.81 83.97,60.81 87.94,56.84 87.94,16.31 77.57,5.94 77.57,2.59 R29.1
VCC
  Top 0.152: IC1.16 68.58,50.75 74.68,44.65 74.68,43.28 U3.7